# Altium schematic sheet Sheet1.SchDoc
size 863 x 558 mm; SheetNumber: 1; SheetTotal: 1
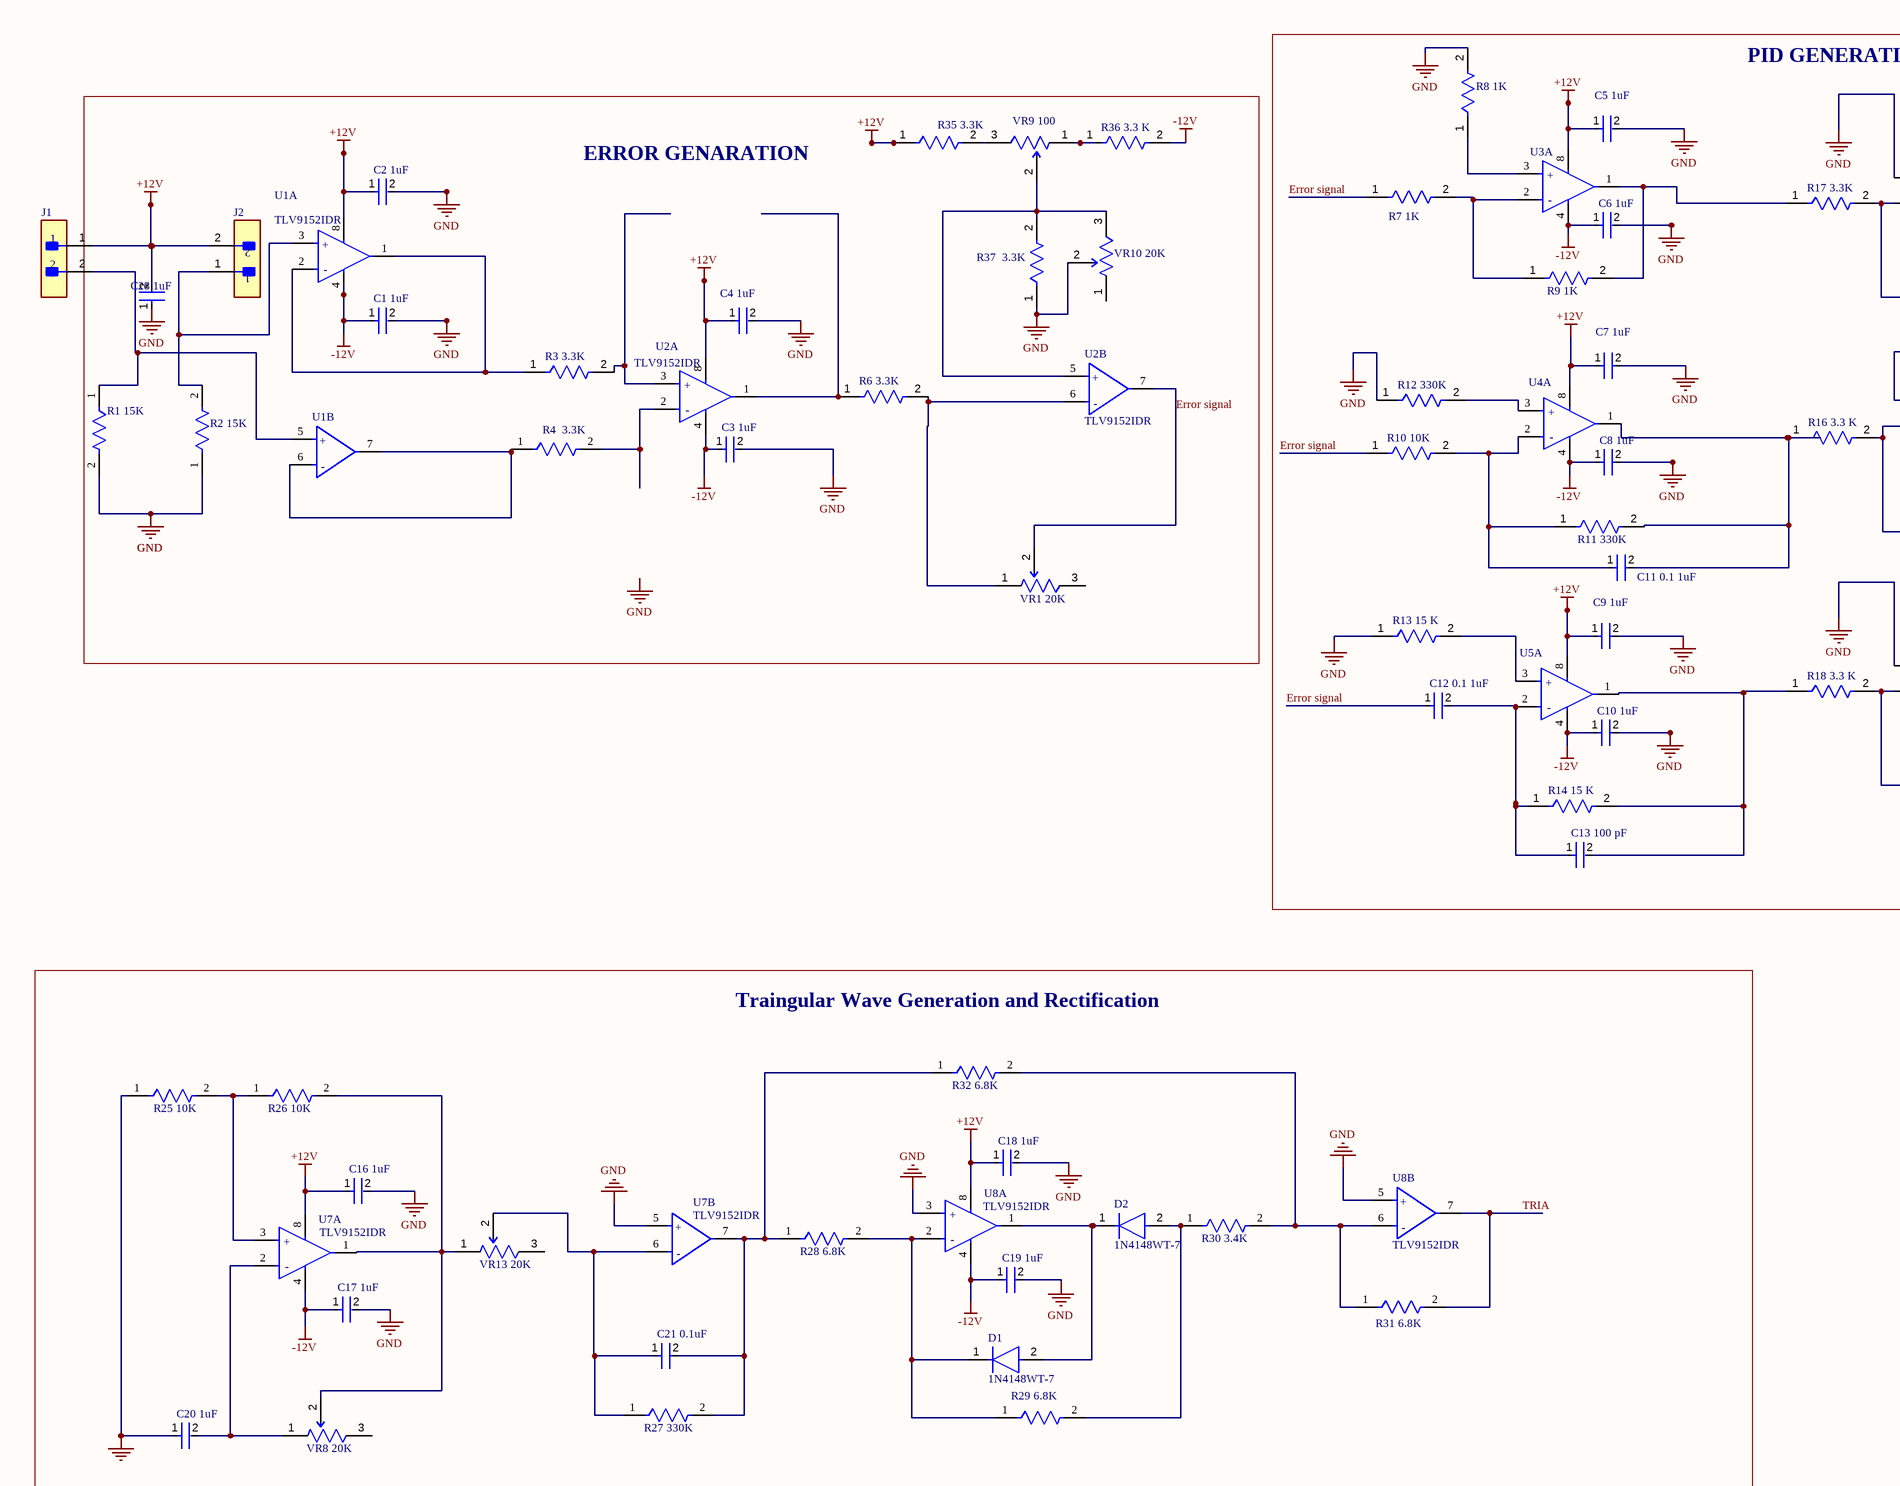
[diagram p0: Sheet1.SchDoc, top left]
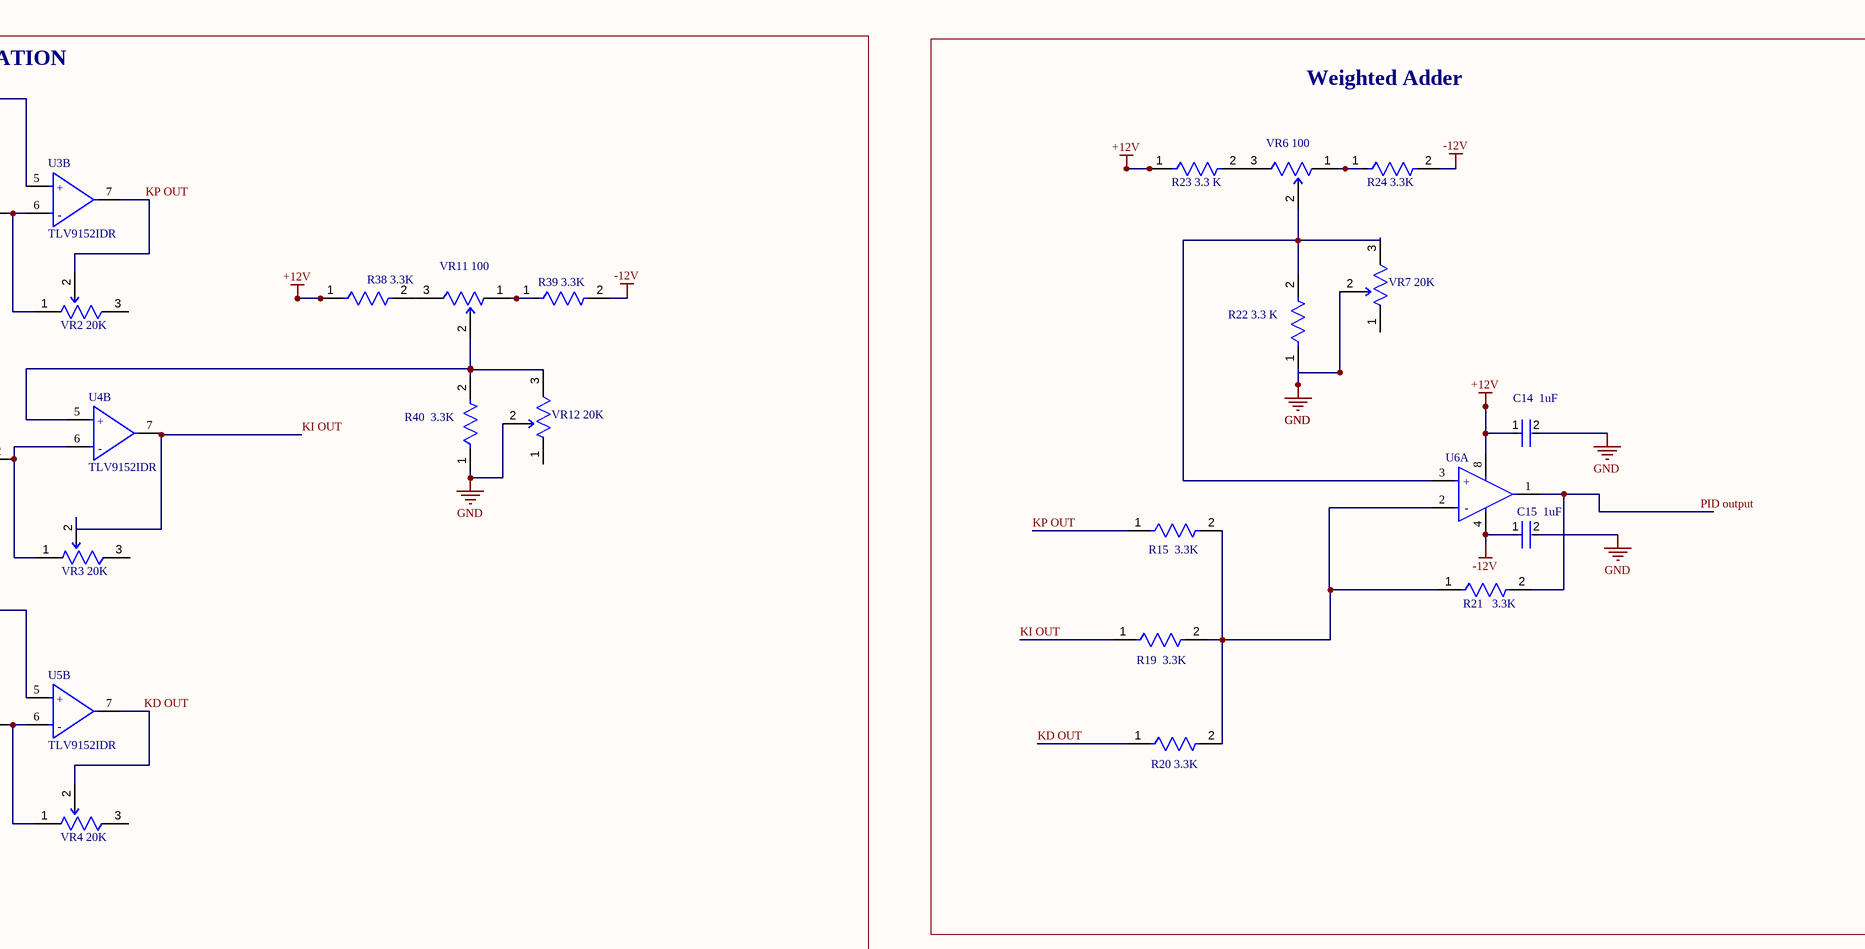
[diagram p1: Sheet1.SchDoc, top right]
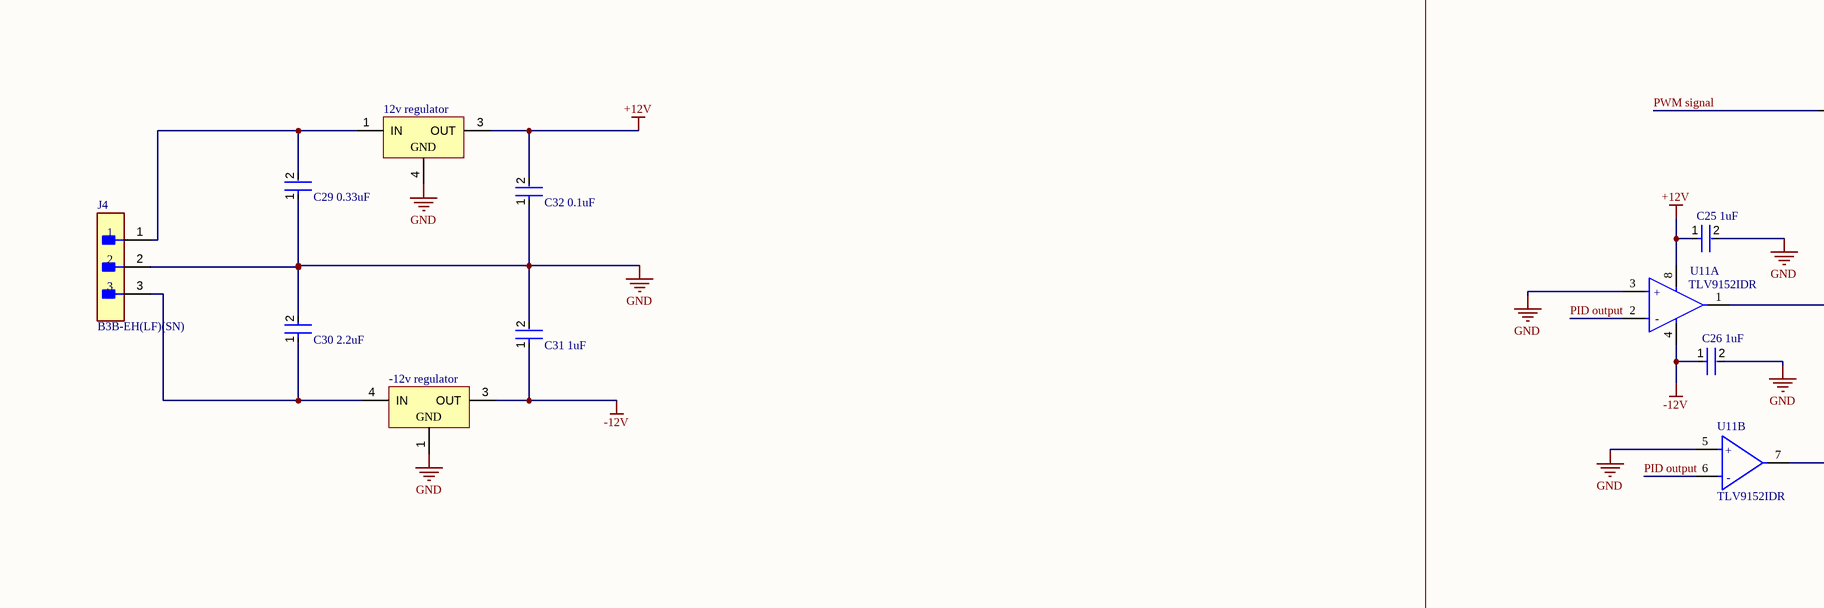
[diagram p2: Sheet1.SchDoc, bottom left]
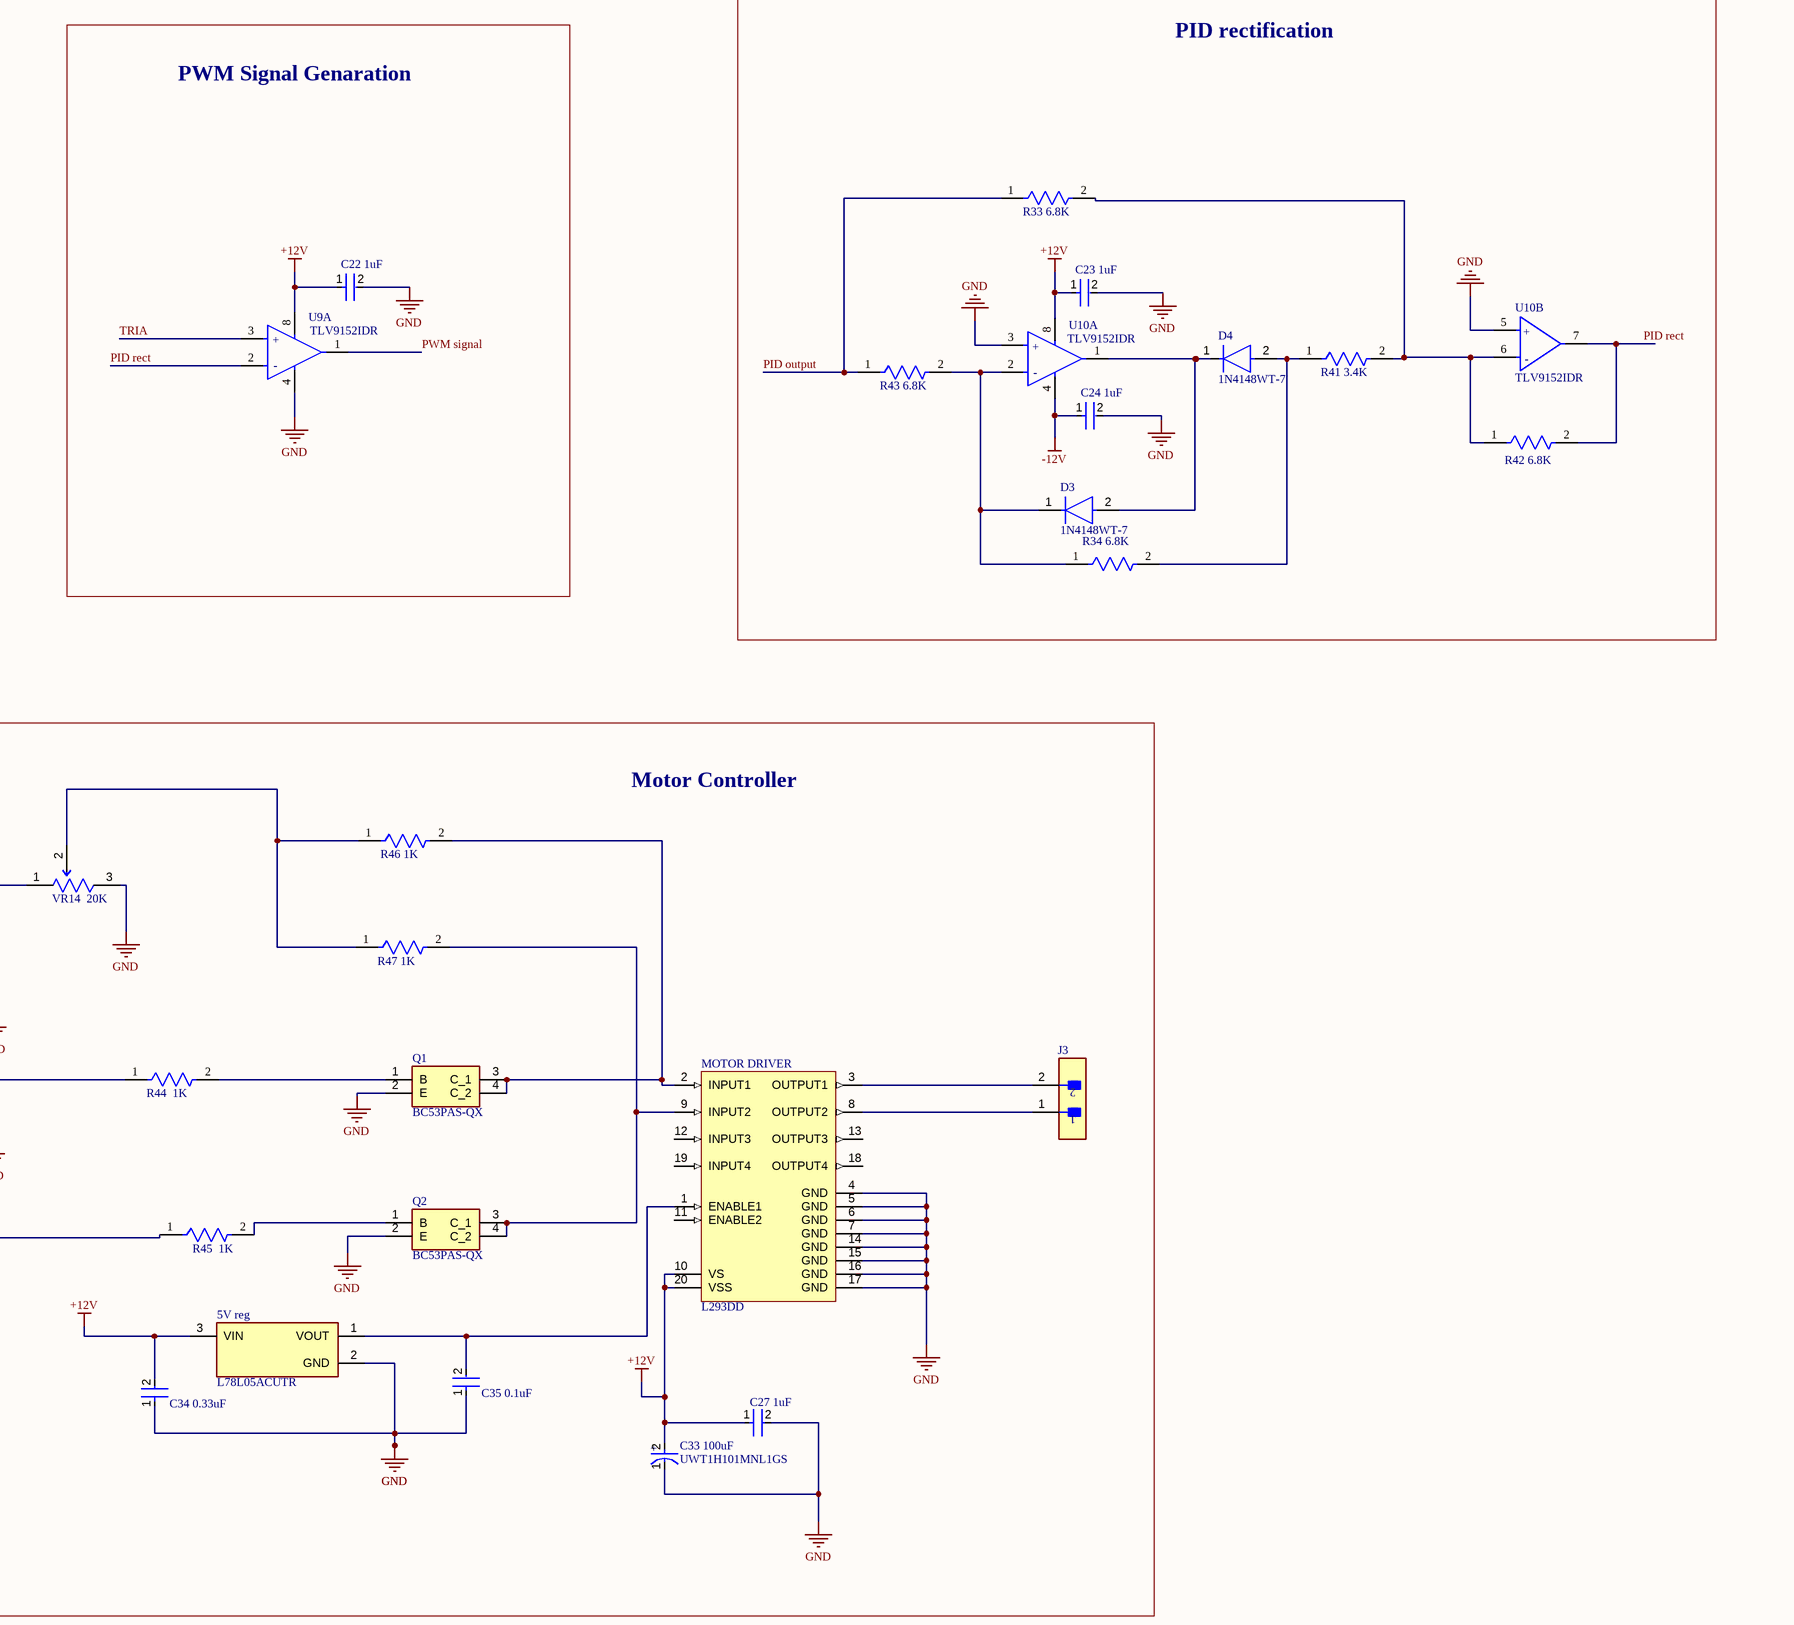
[diagram p3: Sheet1.SchDoc, bottom right]

## Parts
5V_reg  L78L05ACUTR  [FP-SOT-89-7098166-MFG]
12v_regulator  L7812ABD2T-TR  [TO-263_L]  (value not drawn)
-12v_regulator  L7912CD2T-TR  [TO-263_L]  (value not drawn)
C1_1uF  12063C105MAT2A  [FP-1206-L_3_2_0_2-W_1_6_0-IPC_C]  (value not drawn)
C2_1uF  12063C105MAT2A  [FP-1206-L_3_2_0_2-W_1_6_0-IPC_C]  (value not drawn)
C3_1uF  12063C105MAT2A  [FP-1206-L_3_2_0_2-W_1_6_0-IPC_C]  (value not drawn)
C4_1uF  12063C105MAT2A  [FP-1206-L_3_2_0_2-W_1_6_0-IPC_C]  (value not drawn)
C5_1uF  12063C105MAT2A  [FP-1206-L_3_2_0_2-W_1_6_0-IPC_C]  (value not drawn)
C6_1uF  12063C105MAT2A  [FP-1206-L_3_2_0_2-W_1_6_0-IPC_C]  (value not drawn)
C7_1uF  12063C105MAT2A  [FP-1206-L_3_2_0_2-W_1_6_0-IPC_C]  (value not drawn)
C8_1uF  12063C105MAT2A  [FP-1206-L_3_2_0_2-W_1_6_0-IPC_C]  (value not drawn)
C9_1uF  12063C105MAT2A  [FP-1206-L_3_2_0_2-W_1_6_0-IPC_C]  (value not drawn)
C10_1uF  12063C105MAT2A  [FP-1206-L_3_2_0_2-W_1_6_0-IPC_C]  (value not drawn)
C11_0.1_1uF  12063C105MAT2A  [FP-1206-L_3_2_0_2-W_1_6_0-IPC_C]  (value not drawn)
C12_0.1_1uF  12063C105MAT2A  [FP-1206-L_3_2_0_2-W_1_6_0-IPC_C]  (value not drawn)
C13_100_pF  12063C105MAT2A  [FP-1206-L_3_2_0_2-W_1_6_0-IPC_C]  (value not drawn)
C14_1uF  12063C105MAT2A  [FP-1206-L_3_2_0_2-W_1_6_0-IPC_C]  (value not drawn)
C15_1uF  12063C105MAT2A  [FP-1206-L_3_2_0_2-W_1_6_0-IPC_C]  (value not drawn)
C16_1uF  12063C105MAT2A  [FP-1206-L_3_2_0_2-W_1_6_0-IPC_C]  (value not drawn)
C17_1uF  12063C105MAT2A  [FP-1206-L_3_2_0_2-W_1_6_0-IPC_C]  (value not drawn)
C18_1uF  12063C105MAT2A  [FP-1206-L_3_2_0_2-W_1_6_0-IPC_C]  (value not drawn)
C19_1uF  12063C105MAT2A  [FP-1206-L_3_2_0_2-W_1_6_0-IPC_C]  (value not drawn)
C20_1uF  12063C105MAT2A  [FP-1206-L_3_2_0_2-W_1_6_0-IPC_C]  (value not drawn)
C21_0.1uF  12063C105MAT2A  [FP-1206-L_3_2_0_2-W_1_6_0-IPC_C]  (value not drawn)
C22_1uF  12063C105MAT2A  [FP-1206-L_3_2_0_2-W_1_6_0-IPC_C]  (value not drawn)
C23_1uF  12063C105MAT2A  [FP-1206-L_3_2_0_2-W_1_6_0-IPC_C]  (value not drawn)
C24_1uF  12063C105MAT2A  [FP-1206-L_3_2_0_2-W_1_6_0-IPC_C]  (value not drawn)
C25_1uF  12063C105MAT2A  [FP-1206-L_3_2_0_2-W_1_6_0-IPC_C]  (value not drawn)
C26_1uF  12063C105MAT2A  [FP-1206-L_3_2_0_2-W_1_6_0-IPC_C]  (value not drawn)
C27_1uF  12063C105MAT2A  [FP-1206-L_3_2_0_2-W_1_6_0-IPC_C]  (value not drawn)
C28_1uF  12063C105MAT2A  [FP-1206-L_3_2_0_2-W_1_6_0-IPC_C]  (value not drawn)
C29_0.33uF  12063C105MAT2A  [FP-1206-L_3_2_0_2-W_1_6_0-IPC_C]  (value not drawn)
C30_2.2uF  12063C105MAT2A  [FP-1206-L_3_2_0_2-W_1_6_0-IPC_C]  (value not drawn)
C31_1uF  12063C105MAT2A  [FP-1206-L_3_2_0_2-W_1_6_0-IPC_C]  (value not drawn)
C32_0.1uF  12063C105MAT2A  [FP-1206-L_3_2_0_2-W_1_6_0-IPC_C]  (value not drawn)
C33_100uF  UWT1H101MNL1GS  [FP-UWT1H101MNL1GS-MFG]
C34_0.33uF  12063C105MAT2A  [FP-1206-L_3_2_0_2-W_1_6_0-IPC_C]  (value not drawn)
C35_0.1uF  12063C105MAT2A  [FP-1206-L_3_2_0_2-W_1_6_0-IPC_C]  (value not drawn)
D1  1N4148WT-7  [FP-SOD523-MFG]
D2  1N4148WT-7  [FP-SOD523-MFG]
D3  1N4148WT-7  [FP-SOD523-MFG]
D4  1N4148WT-7  [FP-SOD523-MFG]
J1  B2B-EH-A(LF)(SN)  [FP-B2B-EH-A_LF_SN-MFG]  (value not drawn)
J2  B2B-EH-A(LF)(SN)  [FP-B2B-EH-A_LF_SN-MFG]  (value not drawn)
J3  B2B-EH-A(LF)(SN)  [FP-B2B-EH-A_LF_SN-MFG]  (value not drawn)
J4  B3B-EH(LF)(SN)  [FP-B3B-EH_LF_SN-MFG]
MOTOR_DRIVER  L293DD  [STM-SOIC-20_M]
Q1  BC53PAS-QX  [BC53PASQX]
Q2  BC53PAS-QX  [BC53PASQX]
R1_15K  ERJ-8ENF1502V  [FP-ERJ8EN-MFG]  (value not drawn)
R2_15K  ERJ-8ENF1502V  [FP-ERJ8EN-MFG]  (value not drawn)
R3_3.3K  CRCW120610K0FKEA  [FP-CRCW1206-e3-IPC_C]  (value not drawn)
R4_3.3K  ERJ-8ENF1502V  [FP-ERJ8EN-MFG]  (value not drawn)
R6_3.3K  CRCW120610K0FKEA  [FP-CRCW1206-e3-IPC_C]  (value not drawn)
R7_1K  CRCW120610K0FKEA  [FP-CRCW1206-e3-IPC_C]  (value not drawn)
R8_1K  CRCW120610K0FKEA  [FP-CRCW1206-e3-IPC_C]  (value not drawn)
R9_1K  CRCW120610K0FKEA  [FP-CRCW1206-e3-IPC_C]  (value not drawn)
R10_10K  CRCW120610K0FKEA  [FP-CRCW1206-e3-IPC_C]  (value not drawn)
R11_330K  CRCW120610K0FKEA  [FP-CRCW1206-e3-IPC_C]  (value not drawn)
R12_330K  CRCW120610K0FKEA  [FP-CRCW1206-e3-IPC_C]  (value not drawn)
R13_15_K  CRCW120610K0FKEA  [FP-CRCW1206-e3-IPC_C]  (value not drawn)
R14_15_K  CRCW120610K0FKEA  [FP-CRCW1206-e3-IPC_C]  (value not drawn)
R15_3.3K  CRCW120610K0FKEA  [FP-CRCW1206-e3-IPC_C]  (value not drawn)
R16_3.3_K  CRCW120610K0FKEA  [FP-CRCW1206-e3-IPC_C]  (value not drawn)
R17_3.3K  CRCW120610K0FKEA  [FP-CRCW1206-e3-IPC_C]  (value not drawn)
R18_3.3_K  CRCW120610K0FKEA  [FP-CRCW1206-e3-IPC_C]  (value not drawn)
R19_3.3K  CRCW120610K0FKEA  [FP-CRCW1206-e3-IPC_C]  (value not drawn)
R20_3.3K  CRCW120610K0FKEA  [FP-CRCW1206-e3-IPC_C]  (value not drawn)
R21_3.3K  CRCW120610K0FKEA  [FP-CRCW1206-e3-IPC_C]  (value not drawn)
R22_3.3_K  CRCW120610K0FKEA  [FP-CRCW1206-e3-IPC_C]  (value not drawn)
R23_3.3_K  CRCW120610K0FKEA  [FP-CRCW1206-e3-IPC_C]  (value not drawn)
R24_3.3K  CRCW120610K0FKEA  [FP-CRCW1206-e3-IPC_C]  (value not drawn)
R25_10K  ERJ-8ENF1502V  [FP-ERJ8EN-MFG]  (value not drawn)
R26_10K  ERJ-8ENF1502V  [FP-ERJ8EN-MFG]  (value not drawn)
R27_330K  ERJ-8ENF1502V  [FP-ERJ8EN-MFG]  (value not drawn)
R28_6.8K  ERJ-8ENF1502V  [FP-ERJ8EN-MFG]  (value not drawn)
R29_6.8K  ERJ-8ENF1502V  [FP-ERJ8EN-MFG]  (value not drawn)
R30_3.4K  ERJ-8ENF1502V  [FP-ERJ8EN-MFG]  (value not drawn)
R31_6.8K  ERJ-8ENF1502V  [FP-ERJ8EN-MFG]  (value not drawn)
R32_6.8K  ERJ-8ENF1502V  [FP-ERJ8EN-MFG]  (value not drawn)
R33_6.8K  ERJ-8ENF1502V  [FP-ERJ8EN-MFG]  (value not drawn)
R34_6.8K  ERJ-8ENF1502V  [FP-ERJ8EN-MFG]  (value not drawn)
R35_3.3K  CRCW120610K0FKEA  [FP-CRCW1206-e3-IPC_C]  (value not drawn)
R36_3.3_K  CRCW120610K0FKEA  [FP-CRCW1206-e3-IPC_C]  (value not drawn)
R37_3.3K  CRCW120610K0FKEA  [FP-CRCW1206-e3-IPC_C]  (value not drawn)
R38_3.3K  CRCW120610K0FKEA  [FP-CRCW1206-e3-IPC_C]  (value not drawn)
R39_3.3K  CRCW120610K0FKEA  [FP-CRCW1206-e3-IPC_C]  (value not drawn)
R40_3.3K  CRCW120610K0FKEA  [FP-CRCW1206-e3-IPC_C]  (value not drawn)
R41_3.4K  ERJ-8ENF1502V  [FP-ERJ8EN-MFG]  (value not drawn)
R42_6.8K  ERJ-8ENF1502V  [FP-ERJ8EN-MFG]  (value not drawn)
R43_6.8K  ERJ-8ENF1502V  [FP-ERJ8EN-MFG]  (value not drawn)
R44_1K  ERJ-8ENF1502V  [FP-ERJ8EN-MFG]  (value not drawn)
R45_1K  ERJ-8ENF1502V  [FP-ERJ8EN-MFG]  (value not drawn)
R46_1K  ERJ-8ENF1502V  [FP-ERJ8EN-MFG]  (value not drawn)
R47_1K  ERJ-8ENF1502V  [FP-ERJ8EN-MFG]  (value not drawn)
U1  TLV9152IDR  [FP-D0008A-IPC_A]  (parts A,B of 2)
U2  TLV9152IDR  [FP-D0008A-IPC_A]  (parts A,B of 2)
U3  TLV9152IDR  [FP-D0008A-IPC_A]  (value not drawn)  (parts A,B of 2)
U4  TLV9152IDR  [FP-D0008A-IPC_A]  (value not drawn)  (parts A,B of 2)
U5  TLV9152IDR  [FP-D0008A-IPC_A]  (value not drawn)  (parts A,B of 2)
U6  TLV9152IDR  [FP-D0008A-IPC_A]  (value not drawn)  (part A of 2)
U7  TLV9152IDR  [FP-D0008A-IPC_A]  (parts A,B of 2)
U8  TLV9152IDR  [FP-D0008A-IPC_A]  (parts A,B of 2)
U9  TLV9152IDR  [FP-D0008A-IPC_A]  (part A of 2)
U10  TLV9152IDR  [FP-D0008A-IPC_A]  (parts A,B of 2)
U11  TLV9152IDR  [FP-D0008A-IPC_A]  (parts A,B of 2)
VR1_20K  3296W-1-103RLF  [FP-3296W-MFG]  (value not drawn)
VR2_20K  3296W-1-103RLF  [FP-3296W-MFG]  (value not drawn)
VR3_20K  3296W-1-103RLF  [FP-3296W-MFG]  (value not drawn)
VR4_20K  3296W-1-103RLF  [FP-3296W-MFG]  (value not drawn)
VR6_100  3296W-1-103RLF  [FP-3296W-MFG]  (value not drawn)
VR7_20K  3296W-1-103RLF  [FP-3296W-MFG]  (value not drawn)
VR8_20K  3296W-1-103RLF  [FP-3296W-MFG]  (value not drawn)
VR9_100  3296W-1-103RLF  [FP-3296W-MFG]  (value not drawn)
VR10_20K  3296W-1-103RLF  [FP-3296W-MFG]  (value not drawn)
VR11_100  3296W-1-103RLF  [FP-3296W-MFG]  (value not drawn)
VR12_20K  3296W-1-103RLF  [FP-3296W-MFG]  (value not drawn)
VR13_20K  3296W-1-103RLF  [FP-3296W-MFG]  (value not drawn)
VR14_20K  3296W-1-103RLF  [FP-3296W-MFG]  (value not drawn)

## Blocks framed on the sheet
PID GENERATION: C5_1uF C6_1uF C7_1uF C8_1uF C9_1uF C10_1uF C11_0.1_1uF C12_0.1_1uF C13_100_pF R7_1K R8_1K R9_1K R10_10K R11_330K R12_330K R13_15_K R14_15_K R16_3.3_K R17_3.3K R18_3.3_K R38_3.3K R39_3.3K R40_3.3K U3-U5 VR2_20K VR3_20K VR4_20K VR11_100 VR12_20K
Weighted Adder: C14_1uF C15_1uF R15_3.3K R19_3.3K R20_3.3K R21_3.3K R22_3.3_K R23_3.3_K R24_3.3K U6 VR6_100 VR7_20K
ERROR GENARATION: C1_1uF C2_1uF C3_1uF C4_1uF C28_1uF J2 R1_15K R2_15K R3_3.3K R4_3.3K R6_3.3K R35_3.3K R36_3.3_K R37_3.3K U1 U2 VR1_20K VR9_100 VR10_20K
Traingular Wave Generation and Rectification: C16_1uF C17_1uF C18_1uF C19_1uF C20_1uF C21_0.1uF D1 D2 R25_10K R26_10K R27_330K R28_6.8K R29_6.8K R30_3.4K R31_6.8K R32_6.8K U7 U8 VR8_20K VR13_20K
PID rectification: C23_1uF C24_1uF D3 D4 R33_6.8K R34_6.8K R41_3.4K R42_6.8K R43_6.8K U10
PWM Signal Genaration: C22_1uF U9
Motor Controller: 5V_reg C25_1uF C26_1uF C27_1uF C33_100uF C34_0.33uF C35_0.1uF J3 MOTOR_DRIVER Q1 Q2 R44_1K R45_1K R46_1K R47_1K U11 VR14_20K

## Nets
+12V: 5V_reg.3(VIN) 12v_regulator.3(OUT) C2_1uF.1 C4_1uF.1 C5_1uF.1 C7_1uF.1 C9_1uF.1 C14_1uF.1 C16_1uF.1 C18_1uF.1 C22_1uF.1 C23_1uF.1 C25_1uF.1 C27_1uF.1 C28_1uF.2 C32_0.1uF.2 C33_100uF.2(A) C34_0.33uF.2 J1.1 J2.2 MOTOR_DRIVER.10(VS) MOTOR_DRIVER.20(VSS) R23_3.3_K.1 R35_3.3K.1 R38_3.3K.1 U1.8(V+) U2.8(V+) U3.8(V+) U4.8(V+) U5.8(V+) U6.8(V+) U7.8(V+) U8.8(V+) U9.8(V+) U10.8(V+) U11.8(V+)
-12V: -12v_regulator.3(OUT) C1_1uF.1 C3_1uF.1 C6_1uF.1 C8_1uF.1 C10_1uF.1 C15_1uF.1 C17_1uF.1 C19_1uF.1 C24_1uF.1 C26_1uF.1 C31_1uF.1 R24_3.3K.2 R36_3.3_K.2 R39_3.3K.2 U1.4(V-) U2.4(V-) U3.4(V-) U4.4(V-) U5.4(V-) U6.4(V-) U7.4(V-) U8.4(V-) U10.4(V-) U11.4(V-)
GND: 5V_reg.2(GND) 12v_regulator.4(GND) -12v_regulator.1(GND) C1_1uF.2 C2_1uF.2 C3_1uF.2 C4_1uF.2 C5_1uF.2 C6_1uF.2 C7_1uF.2 C8_1uF.2 C9_1uF.2 C10_1uF.2 C14_1uF.2 C15_1uF.2 C16_1uF.2 C17_1uF.2 C18_1uF.2 C19_1uF.2 C20_1uF.1 C22_1uF.2 C23_1uF.2 C24_1uF.2 C25_1uF.2 C26_1uF.2 C27_1uF.2 C28_1uF.1 C29_0.33uF.1 C30_2.2uF.2 C31_1uF.2 C32_0.1uF.1 C33_100uF.1(C) C34_0.33uF.1 C35_0.1uF.1 J4.2 MOTOR_DRIVER.4(GND) MOTOR_DRIVER.5(GND) MOTOR_DRIVER.6(GND) MOTOR_DRIVER.7(GND) MOTOR_DRIVER.14(GND) MOTOR_DRIVER.15(GND) MOTOR_DRIVER.16(GND) MOTOR_DRIVER.17(GND) Q1.2(E) Q2.2(E) R1_15K.2 R2_15K.1 R8_1K.2 R12_330K.1 R13_15_K.1 R22_3.3_K.1 R25_10K.1 R37_3.3K.1 R40_3.3K.1 U3.5(IN2+) U5.5(IN2+) U7.5(IN2+) U8.3(IN1+) U8.5(IN2+) U9.4(V-) U10.3(IN1+) U10.5(IN2+) U11.3(IN1+) U11.5(IN2+) VR10_20K.2(WIPER) VR12_20K.2(WIPER) VR14_20K.3(CW)
Error signal: C12_0.1_1uF.1 R7_1K.1 R10_10K.1 U2.7(OUT2) VR1_20K.2(WIPER)
KD OUT: R20_3.3K.1 U5.7(OUT2) VR4_20K.2(WIPER)
KI OUT: R19_3.3K.1 U4.7(OUT2) VR3_20K.2(WIPER)
KP OUT: R15_3.3K.1 U3.7(OUT2) VR2_20K.2(WIPER)
PID output: R21_3.3K.2 R33_6.8K.1 R43_6.8K.1 U6.1(OUT1) U11.2(IN1-) U11.6(IN2-)
PID rect: R42_6.8K.2 U9.2(IN1-) U10.7(OUT2)
PWM signal: U9.1(OUT1) VR14_20K.1(CCW)
TRIA: R31_6.8K.2 U8.7(OUT2) U9.3(IN1+)
Net5V_reg_1: 5V_reg.1(VOUT) C35_0.1uF.2 MOTOR_DRIVER.1(ENABLE1)
Net12v_regulator_1: 12v_regulator.1(IN) C29_0.33uF.2 J4.1
Net-12v_regulator_4: -12v_regulator.4(IN) C30_2.2uF.1 J4.3
NetC11_0.1_1uF_1: C11_0.1_1uF.1 R10_10K.2 R11_330K.1 U4.2(IN1-)
NetC11_0.1_1uF_2: C11_0.1_1uF.2 R11_330K.2 R16_3.3_K.1 U4.1(OUT1)
NetC12_0.1_1uF_2: C12_0.1_1uF.2 C13_100_pF.1 R14_15_K.1 U5.2(IN1-)
NetC13_100_pF_2: C13_100_pF.2 R14_15_K.2 R18_3.3_K.1 U5.1(OUT1)
NetC20_1uF_2: C20_1uF.2 U7.2(IN1-) VR8_20K.1(CCW)
NetC21_0.1uF_1: C21_0.1uF.1 R27_330K.1 U7.6(IN2-) VR13_20K.2(WIPER)
NetC21_0.1uF_2: C21_0.1uF.2 R27_330K.2 R28_6.8K.1 R32_6.8K.1 U7.7(OUT2)
NetD1_1: D1.1(C) R28_6.8K.2 R29_6.8K.1 U8.2(IN1-)
NetD1_2: D1.2(A) D2.1(C) U8.1(OUT1)
NetD2_2: D2.2(A) R29_6.8K.2 R30_3.4K.1
NetD3_1: D3.1(C) R34_6.8K.1 R43_6.8K.2 U10.2(IN1-)
NetD3_2: D3.2(A) D4.1(C) U10.1(OUT1)
NetD4_2: D4.2(A) R34_6.8K.2 R41_3.4K.1
NetJ1_2: J1.2 R1_15K.1 U1.5(IN2+)
NetJ2_1: J2.1 R2_15K.2 U1.3(IN1+)
NetJ3_1: J3.1 MOTOR_DRIVER.8(OUTPUT2)
NetJ3_2: J3.2 MOTOR_DRIVER.3(OUTPUT1)
NetMOTOR_DRIVER_2: MOTOR_DRIVER.2(INPUT1) Q1.3(C_1) Q1.4(C_2) R46_1K.2
NetMOTOR_DRIVER_9: MOTOR_DRIVER.9(INPUT2) Q2.3(C_1) Q2.4(C_2) R47_1K.2
NetQ1_1: Q1.1(B) R44_1K.2
NetQ2_1: Q2.1(B) R45_1K.2
NetR3_3.3K_1: R3_3.3K.1 U1.1(OUT1) U1.2(IN1-)
NetR3_3.3K_2: R3_3.3K.2 U2.3(IN1+)
NetR4_3.3K_1: R4_3.3K.1 U1.6(IN2-) U1.7(OUT2)
NetR4_3.3K_2: R4_3.3K.2 U2.2(IN1-)
NetR6_3.3K_1: R6_3.3K.1 U2.1(OUT1)
NetR6_3.3K_2: R6_3.3K.2 U2.6(IN2-) VR1_20K.1(CCW)
NetR7_1K_2: R7_1K.2 R9_1K.1 U3.2(IN1-)
NetR8_1K_1: R8_1K.1 U3.3(IN1+)
NetR9_1K_2: R9_1K.2 R17_3.3K.1 U3.1(OUT1)
NetR12_330K_2: R12_330K.2 U4.3(IN1+)
NetR13_15_K_2: R13_15_K.2 U5.3(IN1+)
NetR15_3.3K_2: R15_3.3K.2 R19_3.3K.2 R20_3.3K.2 R21_3.3K.1 U6.2(IN1-)
NetR16_3.3_K_2: R16_3.3_K.2 U4.6(IN2-) VR3_20K.1(CCW)
NetR17_3.3K_2: R17_3.3K.2 U3.6(IN2-) VR2_20K.1(CCW)
NetR18_3.3_K_2: R18_3.3_K.2 U5.6(IN2-) VR4_20K.1(CCW)
NetR22_3.3_K_2: R22_3.3_K.2 U6.3(IN1+) VR6_100.2(WIPER) VR7_20K.3(CW)
NetR23_3.3_K_2: R23_3.3_K.2 VR6_100.3(CW)
NetR24_3.3K_1: R24_3.3K.1 VR6_100.1(CCW)
NetR25_10K_2: R25_10K.2 R26_10K.1 U7.3(IN1+)
NetR26_10K_2: R26_10K.2 U7.1(OUT1) VR8_20K.2(WIPER) VR13_20K.1(CCW)
NetR30_3.4K_2: R30_3.4K.2 R31_6.8K.1 R32_6.8K.2 U8.6(IN2-)
NetR33_6.8K_2: R33_6.8K.2 R41_3.4K.2 R42_6.8K.1 U10.6(IN2-)
NetR35_3.3K_2: R35_3.3K.2 VR9_100.3(CW)
NetR36_3.3_K_1: R36_3.3_K.1 VR9_100.1(CCW)
NetR37_3.3K_2: R37_3.3K.2 U2.5(IN2+) VR9_100.2(WIPER) VR10_20K.3(CW)
NetR38_3.3K_2: R38_3.3K.2 VR11_100.3(CW)
NetR39_3.3K_1: R39_3.3K.1 VR11_100.1(CCW)
NetR40_3.3K_2: R40_3.3K.2 U4.5(IN2+) VR11_100.2(WIPER) VR12_20K.3(CW)
NetR44_1K_1: R44_1K.1 U11.1(OUT1)
NetR45_1K_1: R45_1K.1 U11.7(OUT2)
NetR46_1K_1: R46_1K.1 R47_1K.1 VR14_20K.2(WIPER)

Not connected (* = marked no-connect by the designer): MOTOR_DRIVER 11(ENABLE2) 12(INPUT3) 13(OUTPUT3) 18(OUTPUT4) 19(INPUT4); VR1_20K 3(CW); VR2_20K 3(CW); VR3_20K 3(CW); VR4_20K 3(CW); VR7_20K 1(CCW) 2(WIPER); VR8_20K 3(CW); VR10_20K 1(CCW); VR12_20K 1(CCW); VR13_20K 3(CW)

## Notes on the sheet
- Labels drawn without touching a wire or pin: GND
- DWG. NO.
- REV.
- SHT.
- REVISION
- DESCRIPTION
- DATE
- APPROVED
- THIS DOCUMENT AND THE DATA DISCLOSED HEREIN OR HEREWITH IS THE PROPERTY OF ALTIUM LIMITED AND MAY BE FREELY DISTRIBUTED IN WHOLE. NO RIGHTS ARE RESERVED OR EXPRESS OR IMPLIED WARANTEE GIVEN.
- ENG:
- DSN:
- APPROVALS
- PROJECT
- DOCUMENT REVISION:
- DESIGN ITEM:
- CHK:
- BOM:
- REFERENCE DOCUMENTS
- PROJECT REVISION:
- TITLE
- FAB DWG:
- PCB DWG:
- ASSY DWG:
- SCALE:
- SIZE
- D
- CAGE CODE
- FILE NAME
- DWG NO.
- SHEET
- OF
- REV
- (in symbol CMP-2000-07373-2) +
- (in symbol CMP-04895-000148-1, part A) +; -
- (in symbol CMP-04895-000148-1, part B) +; -

## Library data of the parts
5V_reg = CMP-0244-00407-2: IC REG LINEAR 5V 100MA SOT89-3; Output Voltage Accuracy: 4%; Number of Regulators: 1; Polarity: Positive; Quiescent Current: 6mA; Min Input Voltage: 7V; Power Supply Rejection Ratio (PSRR): 49dB; Output Type: Fixed; Max Input Voltage: 30V; Dropout Voltage: 1.7V; Nominal Output Voltage: 5V; Radiation Hardening: No; Number of Pins: 3; Weight: 0.004603oz; Output Current: 100mA; Width: 2.6mm; Packaging: Tape and Reel; Output Voltage: 5V; Length: 4.6mm; Max Output Current: 100mA; Min Operating Temperature: 0°C; Package Quantity: 1; Accuracy: 4%; Case/Package: SOT-89; Lead Free: Lead Free; Height: 1.6mm; Min Output Voltage: 5V; Contact Plating: Tin; Number of Outputs: 1; REACH SVHC: No SVHC; Mount: Surface Mount; Max Operating Temperature: 125°C
12v_regulator = CMP-0244-00181-1: Positive Voltage Regulator, 3-Pin D2PAK, Tape and Reel; ComponentLink1Description: Manufacturer URL; ComponentLink2URL: http://www.st.com/internet/com/TECHNICAL_RESOURCES/TECHNICAL_LITERATURE/DATASHEET/CD00000444.pdf; PackageVersion: 2011; PackageDescription: 3-Pin Transistor Outline Package 2.54 mm Pitch, 15.4 mm Lead Span (D2PAK); DatasheetVersion: 16/11/2011; PackageReference: TO-263; ComponentLink1URL: http://www.st.com; ComponentLink2Description: Datasheet
-12v_regulator = CMP-0244-00212-1: Negative Voltage Regulator, -12V, 3-Pin D2PAK, Tape and Reel; PackageReference: TO-263; PackageVersion: 2011; ComponentLink2Description: Datasheet; DatasheetVersion: 1/11/2011; PackageDescription: 3-Pin Transistor Outline Package 2.54 mm Pitch, 15.4 mm Lead Span (D2PAK); ComponentLink1URL: http://www.st.com; ComponentLink1Description: Manufacturer URL; ComponentLink2URL: http://www.st.com/internet/com/TECHNICAL_RESOURCES/TECHNICAL_LITERATURE/DATASHEET/CD00000450.pdf
C1_1uF C2_1uF C3_1uF C4_1uF C5_1uF C6_1uF C7_1uF C8_1uF C9_1uF C10_1uF C11_0.1_1uF C12_0.1_1uF C13_100_pF C14_1uF C15_1uF C16_1uF C17_1uF C18_1uF C19_1uF C20_1uF C21_0.1uF C22_1uF C23_1uF C24_1uF C25_1uF C26_1uF C27_1uF C28_1uF C29_0.33uF C30_2.2uF C31_1uF C32_0.1uF C34_0.33uF C35_0.1uF = CMP-04427-017534-1: General Purpose Ceramic Capacitor, 1206, 1uF, 20%, X7R, 15%, 25V; Series: -; Voltage Rating (DC): 25V; Depth: 1.6mm; Case/Package: 1206; Contact Plating: Tin; Voltage Rating: 25V; Mount: Surface Mount; Length: 3.2mm; RoHS Compliant: Yes; Case Code (Metric): 3216; Case Code (Imperial): 1206; Termination: SMD/SMT; Width: 0.063inch; Height: 1.78mm; Lead Free: Lead Free; Number of Pins: 2; Dielectric: X7R; REACH SVHC: No SVHC; Min Operating Temperature: -55°C; Capacitance: 1uF; Packaging: Tape and Reel; Max Operating Temperature: 125°C; Thickness: 0.07inch; Radiation Hardening: No; Tolerance: 20%; Construction: Flat; Package Quantity: 1
C33_100uF = CMP-2000-07373-2: CAP ALUM 100UF 20% 50V SMD; Leakage Current: 3uA; Ripple Current: 140mA; Life (Hours): 1000Hour; Dissipation Factor: 0.14%; Dielectric Material: Aluminium; Termination: SMD/SMT; Tolerance: 20%; Package Quantity: 500; Capacitance: 100uF; Height: 10mm; REACH SVHC: No SVHC; Case/Package: Radial; Series: WT; Diameter: 8mm; Voltage Rating: 50V; Construction: Cylindrical; Length: 10mm; Min Operating Temperature: -55°C; Max Operating Temperature: 105°C; Voltage Rating (DC): 50V; Packaging: Tape and Reel; Voltage: 50V; Mount: Surface Mount; Ripple Current (AC): 140mA; Radiation Hardening: No; Number of Pins: 2; Lead Free: Lead Free; Height - Seated (Max): 0.413inch; RoHS Compliant: Yes
D1-D4 = CMP-2000-05518-3: DIODE GEN PURP 80V 125MA SOD523; Power Rating: 150mW; Peak Non-Repetitive Surge Current: 2A; Forward Voltage: 1.25V; Reverse Recovery Time: 4ns; Peak Reverse Current: 1uA; Max Repetitive Reverse Voltage (Vrrm): 100V; Capacitance: 2pF; Polarity: Standard; Element Configuration: Single; Forward Current: 250mA; Lead Free: Lead Free; Packaging: Tape and Reel; Length: 0.9mm; Min Operating Temperature: -65°C; Current Rating: 125mA; Max Reverse Voltage (DC): 80V; Width: 1.3mm; Package Quantity: 3000; Output Current: 125mA; Power Dissipation: 150mW; Max Operating Temperature: 150°C; Radiation Hardening: No; Average Rectified Current: 125mA; Height: 0.65mm; Voltage Rating (DC): 80V; Max Surge Current: 2A; Weight: 3.5E-05oz; Recovery Time: 4ns; Max Forward Surge Current (Ifsm): 2A; Contact Plating: Tin; Number of Pins: 2; Mount: Surface Mount; REACH SVHC: No SVHC
J1-J3 = CMP-17439-000026-1: CONN HEADER VERT 2POS 2.5MM; Number of Contacts: 2; Current Rating: 3A; Connector Type: Plug; Contact Resistance: 20mR; Gender: Male; Voltage Rating: 250V; Fastening Type: Detent; Depth: 3.8mm; Max Operating Temperature: 85°C; Orientation: Straight; Series: EH; Contact Plating: Tin; Min Operating Temperature: -25°C; Contact Type: Male Pin; Housing Color: White; Termination: Press-Fit; Housing Material: Nylon; Pitch: 2.5mm; Number of Positions: 2; Max Current Rating: 3A; Packaging: Bulk; Lead Free: Lead Free; Number of Rows: 1; Length: 7.5mm; Contact Mating Length: 0.13inch; Color: Natural; Max Voltage Rating (AC): 250V; Contact Material: Copper Alloy; Mount: Through Hole
J4 = CMP-17439-000692-1: 3 Position Single Row 2.5 mm Press Fit Through Hole Shrouded Pin Header; Voltage Rating: 250V; Pitch: 2.5mm; Current Rating: 3A; Number of Positions: 3; Termination: Solder; Contact Material: Brass; Series: EH; Mount: Through Hole; Number of Contacts: 3; Number of Rows: 1; Lead Free: Lead Free; Orientation: Straight
MOTOR_DRIVER = CMP-1771-00003-1: Push-Pull Four Channel Driver with Diodes, 4.5 to 36 V, 20-Pin SOIC, RoHS, Tube; Voltage Rating: 50 V; Power Rating: 100 mW; Case\Package: 0603; Resistance: 15 kohm; Tolerance: 1%; REACH SVHC: Unknown; Case Code (Imperial): 0603; ComponentLink2Description: Datasheet; ComponentLink2URL: http://www.st.com/content/ccc/resource/technical/document/datasheet/04/ac/22/f9/20/5d/43/a1/CD00000059.pdf/files/CD00000059.pdf/jcr:content/translations/en.CD00000059.pdf; Max Operating Temperature: 155 degC; Width: 0.8 mm; ComponentLink1URL: http://www.st.com/; ComponentLink1Description: Manufacturer URL; Length: 1.6 mm; Package Quantity: 5000; RoHSCompliant: true; Height: 0.45 mm; Mount: Surface Mount; PackageDescription: 20-Pin Small Outline Integrated Circuit, Body 12.8 x 7.5 mm, Pitch 1.27 mm; PackageReference: SOIC-20; Packaging: Tape and Reel; Min Operating Temperature: -55 degC; Case Code (Metric): 1608; DatasheetVersion: Jul-03
Q1 Q2 = BC53PAS-QX: Transistor BJT PNP; Manufacturer_Name: Nexperia; Datasheet Link: https://assets.nexperia.com/documents/data-sheet/BC53XPAS-Q_SER.pdf; Height: 0.65mm; Manufacturer_Part_Number: BC53PAS-QX; Mouser Part Number: 771-BC53PAS-QX; Mouser Price/Stock: https://www.mouser.co.uk/ProductDetail/Nexperia/BC53PAS-QX?qs=Y0Uzf4wQF3mcJPegYmfiPg%3D%3D
R1_15K = CMP-2003-00118-2: 15K; NexarPartId: 55423295; Voltage Rating: 200V; Temperature Coefficient: 100ppm/°C; Resistance: 15kΩ; Max Power Dissipation: 250mW; Tolerance: 1%; Military Standard: Not; Min Operating Temperature: -55°C; Height: 600µm; Termination: SMD/SMT; Composition: Thick Film; Mount: Surface Mount; Voltage Rating (DC): 200V; Lead Free: Lead Free; Features: Automotive AEC-Q200; Radiation Hardening: No; Number of Terminations: 2; Contact Plating: Tin; Lifecycle Status: Production; Schedule B: 8533210045, 8533210045; Max Operating Temperature: 155°C; Packaging: Cut Tape (CT); Length: 3.2mm; Power Rating: 250mW; Width: 1.6mm; RoHS: Compliant; Number of Pins: 2; Depth: 1.6mm; Case Code (Imperial): 1206; Case/Package: 1206; REACH SVHC: No SVHC; Case Code (Metric): 3216
R2_15K R4_3.3K R25_10K R26_10K R27_330K R28_6.8K R29_6.8K R30_3.4K R31_6.8K R32_6.8K R33_6.8K R34_6.8K R41_3.4K R42_6.8K R43_6.8K R44_1K R45_1K R46_1K R47_1K = CMP-2003-00118-2: NexarPartId: 55423295; Voltage Rating: 200V; Temperature Coefficient: 100ppm/°C; Resistance: 15kΩ; Max Power Dissipation: 250mW; Tolerance: 1%; Military Standard: Not; Min Operating Temperature: -55°C; Height: 600µm; Termination: SMD/SMT; Composition: Thick Film; Mount: Surface Mount; Voltage Rating (DC): 200V; Lead Free: Lead Free; Features: Automotive AEC-Q200; Radiation Hardening: No; Number of Terminations: 2; Contact Plating: Tin; Lifecycle Status: Production; Schedule B: 8533210045, 8533210045; Max Operating Temperature: 155°C; Packaging: Cut Tape (CT); Length: 3.2mm; Power Rating: 250mW; Width: 1.6mm; RoHS: Compliant; Number of Pins: 2; Depth: 1.6mm; Case Code (Imperial): 1206; Case/Package: 1206; REACH SVHC: No SVHC; Case Code (Metric): 3216
R3_3.3K R6_3.3K R7_1K R8_1K R9_1K R10_10K R11_330K R12_330K R13_15_K R14_15_K R15_3.3K R16_3.3_K R17_3.3K R18_3.3_K R19_3.3K R20_3.3K R21_3.3K R22_3.3_K R23_3.3_K R24_3.3K R35_3.3K R36_3.3_K R37_3.3K R38_3.3K R39_3.3K R40_3.3K = CMP-2003-04807-2: RES Thick Film, 10kΩ, 1%, 0.25W, 100ppm/°C, 1206; Working Voltage: 200V; Max Power Dissipation: 250mW; Resistance: 10kR; Tolerance: 1%; Width: 0.063inch; Height: 0.55mm; Number of Pins: 2; Voltage Rating: 200V; Temperature Coefficient: 100ppm/°C; Military Standard: Not; Features: Automotive AEC-Q200; Depth: 1.6mm; Radiation Hardening: No; Termination: SMD/SMT; Case Code (Imperial): 1206; Weight: 0.000353oz; Length: 3.2mm; Package Quantity: 10; Voltage Rating (DC): 200V; Case/Package: 1206; Min Operating Temperature: -55°C; Number of Terminations: 2; Composition: Thick Film; Contact Plating: Tin; Power Rating: 250mW; Packaging: Tape and Reel; Max Operating Temperature: 155°C; Lead Free: Lead Free; Case Code (Metric): 3216
U1-U11 = CMP-04895-000148-1: IC OPAMP GP 2 CIRCUIT 8SOIC
VR1_20K VR2_20K VR3_20K VR4_20K VR6_100 VR7_20K VR8_20K VR9_100 VR10_20K VR11_100 VR12_20K VR13_20K VR14_20K = CMP-07234-000024-1: TRIMMER 10K OHM 0.5W PC PIN TOP; Resistance: 10kR; Temperature Coefficient: 100ppm/°C; Power Rating: 500mW; Tolerance: 10%; Number of Turns: 25; Width: 0.19inch; Termination: Pin; Radiation Hardening: No; Contact Plating: Tin; Composition: Cermet; Length: 9.53mm; Height: 0.395inch; Depth: 4.83mm; REACH SVHC: No SVHC; Weight: 0.03oz; Min Operating Temperature: -55°C; Military Standard: Not; Max Operating Temperature: 125°C; Packaging: Tape and Reel; Package Quantity: 1; Taper: Linear; Max Power Dissipation: 500mW; Mount: Through Hole